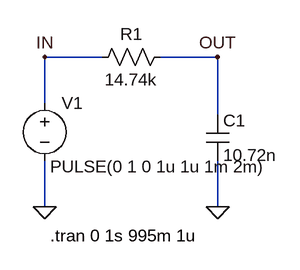
[diagram p0: schematic 1-1_Integrating_circuit.asc]
1-1_Integrating_circuit.asc, the LTspice schematic file:
Version 4.1
SHEET 1 880 680
WIRE -48 48 -128 48
WIRE 112 48 32 48
WIRE -128 112 -128 48
WIRE 112 128 112 48
WIRE -128 256 -128 192
WIRE 112 256 112 192
FLAG 112 256 0
FLAG -128 256 0
FLAG -128 48 IN
FLAG 112 48 OUT
SYMBOL res 48 32 R90
WINDOW 0 0 56 VBottom 2
WINDOW 3 32 56 VTop 2
SYMATTR InstName R1
SYMATTR Value 14.74k
SYMBOL cap 96 128 R0
SYMATTR InstName C1
SYMATTR Value 10.72n
SYMBOL voltage -128 96 R0
WINDOW 3 8 104 Left 2
WINDOW 123 0 0 Left 0
WINDOW 39 0 0 Left 0
SYMATTR Value PULSE(0 1 0 1u 1u 1m 2m)
SYMATTR InstName V1
TEXT -120 296 Left 2 !.tran 0 1s 995m 1u

The netlist it stands for:
* 1-1_Integrating_circuit.asc
R1 OUT IN 14.74k
C1 OUT 0 10.72n
V1 IN 0 PULSE(0 1 0 1u 1u 1m 2m)
.tran 0 1s 995m 1u
.backanno
.end